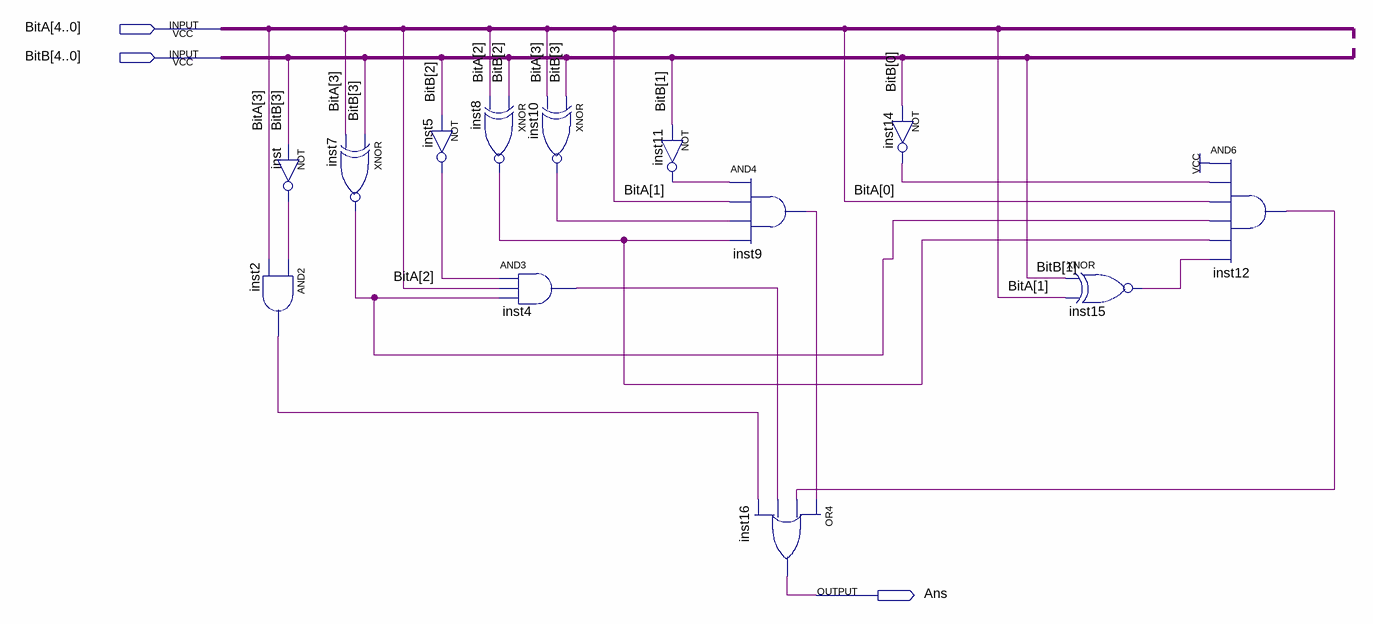
[diagram p0: schematic sheet]
// Quartus schematic Comparison_module.bdf as structural Verilog: 13 symbols, 3 pins
module Comparison_module (
  input  [4:0] BitA,
  input  [4:0] BitB,
  output Ans
);

  wire inst2_out, inst4_out, inst5_out, inst7_out, inst8_out, inst9_out, inst10_out, inst11_out, inst12_out,
       inst14_out, inst15_out, inst_out;

  not inst (inst_out, BitB[3]);
  and inst2 (inst2_out, inst_out, BitA[3]);
  xnor inst7 (inst7_out, BitB[3], BitA[3]);
  not inst5 (inst5_out, BitB[2]);
  xnor inst8 (inst8_out, BitB[2], BitA[2]);
  and inst4 (inst4_out, inst5_out, BitA[2], inst7_out);
  xnor inst10 (inst10_out, BitB[3], BitA[3]);
  not inst11 (inst11_out, BitB[1]);
  and inst9 (inst9_out, inst11_out, BitA[1], inst10_out, inst8_out);
  or inst16 (Ans, inst9_out, inst12_out, inst4_out, inst2_out);
  not inst14 (inst14_out, BitB[0]);
  xnor inst15 (inst15_out, BitB[1], BitA[1]);
  and inst12 (inst12_out, 1'b1, inst14_out, BitA[0], inst7_out, inst8_out, inst15_out);
endmodule
